# EAGLE design siguelineas (EAGLE 7.2.0)
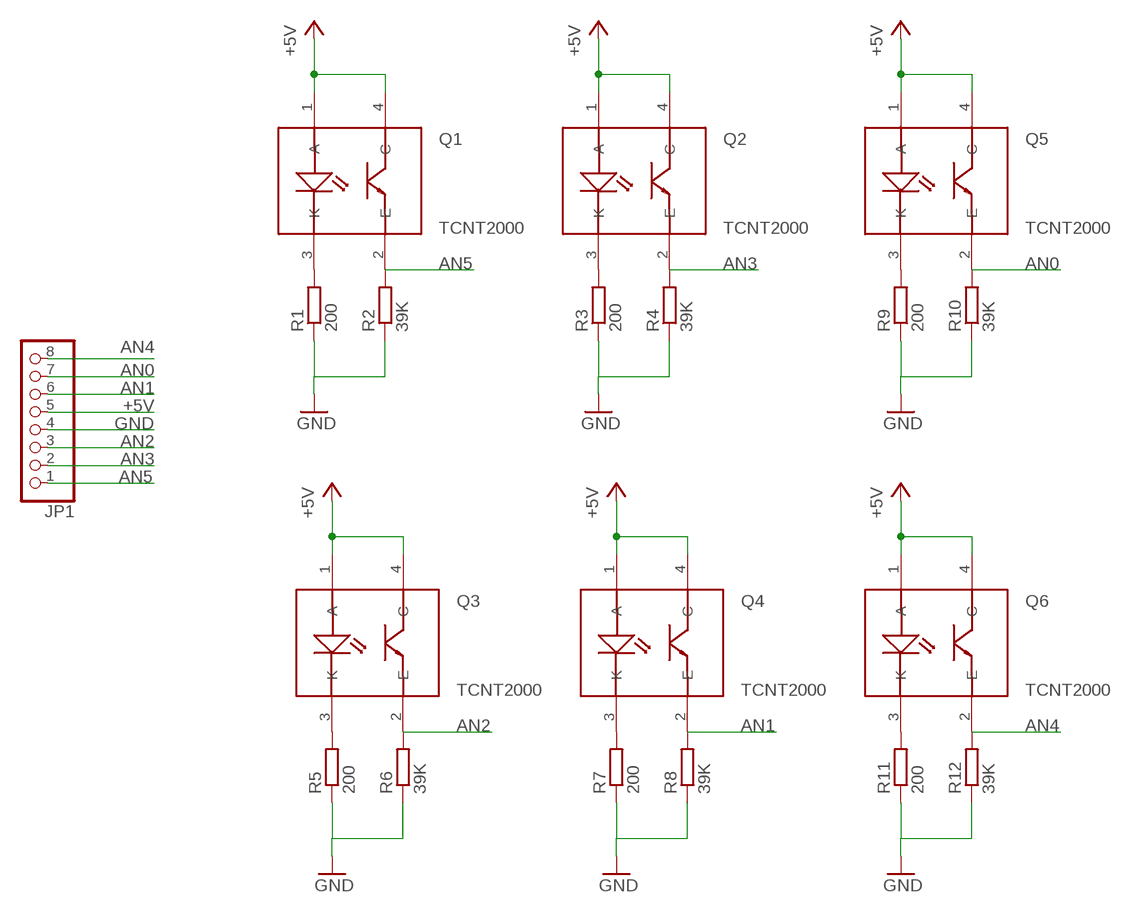
[diagram p0: schematic, sheet 1]

## Parts
JP1  PINHD-1X8  [1X08]
Q1  TCNT2000  [SMD]
Q2  TCNT2000  [SMD]
Q3  TCNT2000  [SMD]
Q4  TCNT2000  [SMD]
Q5  TCNT2000  [SMD]
Q6  TCNT2000  [SMD]
R1  200  R-EU_R0805  [R0805]
R2  39K  R-EU_R0805  [R0805]
R3  200  R-EU_R0805  [R0805]
R4  39K  R-EU_R0805  [R0805]
R5  200  R-EU_R0805  [R0805]
R6  39K  R-EU_R0805  [R0805]
R7  200  R-EU_R0805  [R0805]
R8  39K  R-EU_R0805  [R0805]
R9  200  R-EU_R0805  [R0805]
R10  39K  R-EU_R0805  [R0805]
R11  200  R-EU_R0805  [R0805]
R12  39K  R-EU_R0805  [R0805]

## Nets
+5V: JP1.5 Q1.1(A) Q1.4(C) Q2.1(A) Q2.4(C) Q3.1(A) Q3.4(C) Q4.1(A) Q4.4(C) Q5.1(A) Q5.4(C) Q6.1(A) Q6.4(C)
AN0: JP1.7 Q5.2(E) R10.2
AN1: JP1.6 Q4.2(E) R8.2
AN2: JP1.3 Q3.2(E) R6.2
AN3: JP1.2 Q2.2(E) R4.2
AN4: JP1.8 Q6.2(E) R12.2
AN5: JP1.1 Q1.2(E) R2.2
GND: JP1.4 R1.1 R2.1 R3.1 R4.1 R5.1 R6.1 R7.1 R8.1 R9.1 R10.1 R11.1 R12.1
N$1: Q1.3(K) R1.2
N$2: Q2.3(K) R3.2
N$3: Q3.3(K) R5.2
N$4: Q4.3(K) R7.2
N$5: Q5.3(K) R9.2
N$6: Q6.3(K) R11.2

## Library data of the parts
JP1 = pinhead:PINHD-1X8: PIN HEADER
Q1-Q6 = Siguelineas:TCNT2000
R1-R12 = rcl:R-EU_: RESISTOR, European symbol

## Board
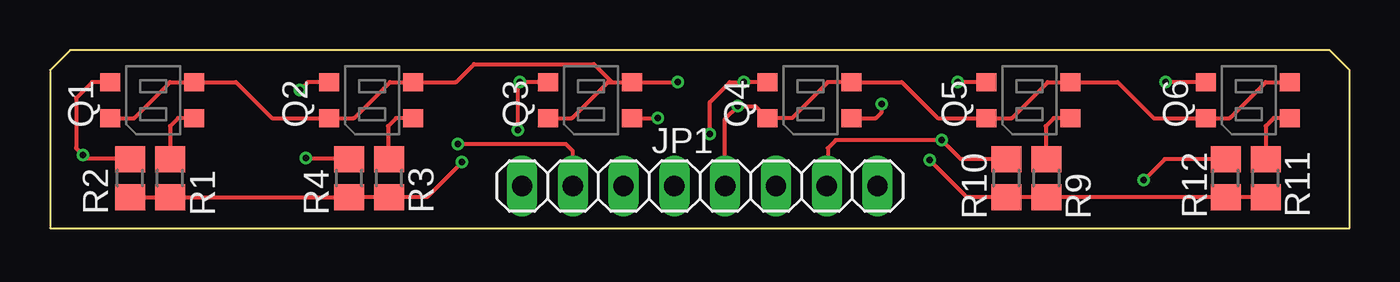
[diagram p1: board, top side]
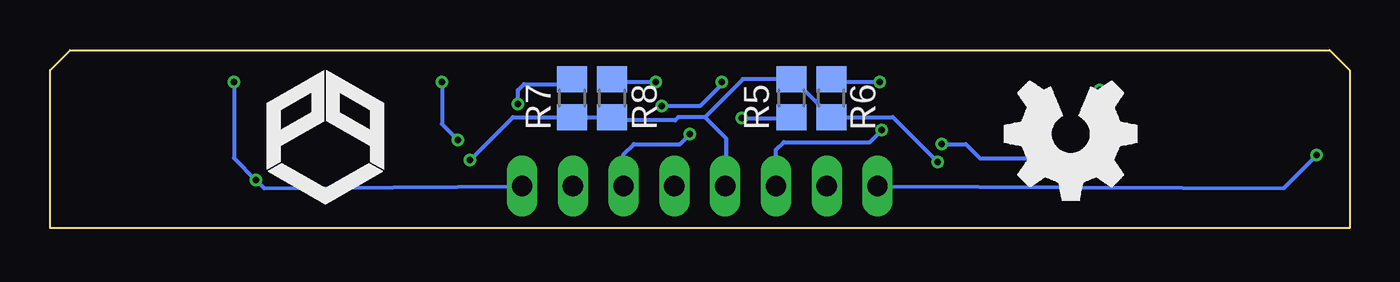
[diagram p2: board, bottom side, seen from below]

Size 65 x 8.9 mm. Coordinates in mm from the lower left corner, seen from the top.
Outline: 0,0 65,0 65,7.9 64,8.9 1,8.9 0,7.9 0,0
Copper layers (1*16): Top 0.035mm / dielectric 1.5mm / Bottom 0.035mm
Design rules "EagleRules": minimum track width 7mil, minimum drill 12mil, track to track 7mil, track to pad 7mil, pad to pad 7mil, via to via 7mil, smd to smd 0mil, copper to edge 20mil, drill to drill 10mil, minimum pad ring 10mil, minimum via ring 6mil, stop-mask expansion 2mil, vias tented up to drill 25mil, thermal gap 10mil

### Footprints (pad centres in the part's own frame; a part is rotated, then mirrored left to right if it is on the bottom)
1X08 = drill 1.016 long: 1 -8.89,0; 2 -6.35,0; 3 -3.81,0; 4 -1.27,0; 5 1.27,0; 6 3.81,0; 7 6.35,0; 8 8.89,0
SMD = smd 0.9 x 1: 1 0,0; 2 1.8,0; 3 0,-4.2; 4 1.8,-4.2
R0805 = smd 1.3 x 1.5: 1 -0.95,0; 2 0.95,0

### Placement (x,y rotation side)
JP1  32.5,2.1 0 top
Q1  3,5.5 90 top
Q2  13.96,5.5 90 top
Q3  24.92,5.5 90 top
Q4  35.88,5.5 90 top
Q5  46.84,5.5 90 top
Q6  57.8,5.5 90 top
R1  6,2.5 90 top
R2  4,2.5 90 top
R3  16.96,2.5 90 top
R4  14.96,2.5 90 top
R5  27.92,6.5 270 bottom
R6  25.92,6.5 90 bottom
R7  38.88,6.5 90 bottom
R8  36.88,6.5 90 bottom
R9  49.84,2.5 90 top
R10  47.84,2.5 90 top
R11  60.8,2.5 90 top
R12  58.8,2.5 90 top

### Tracks (layer width: path | path; a pad name or v marks a point on that pad's centre or on a via)
+5V  (via drill 0.3 pad 0.61)
  Top 0.203: Q1.1 4.2,5.5 6,7.3 Q1.4 9.3,7.3 11.1,5.5 Q2.1 15.2,5.5 17,7.3 Q2.4 20.3,7.3 21.2,8.2 27.2,8.2 28.1,7.3 | Q3.1 26.1,5.5 27.9,7.3 28.1,7.3 | 28.1,7.3 Q3.4 v31.4,7.3 | Q6.4 60.8,7.3 59,5.5 Q6.1 55.2,5.5 53.4,7.3 Q5.4 49.9,7.3 48.1,5.5 Q5.1 44.4,5.5 42.6,7.3 Q4.4 38.9,7.3 37.1,5.5 Q4.1 35.28,6.1 v34.4,6.1 33.77,5.47 JP1.5
  Bottom 0.203: v31.4,7.3 31.4,7.2 32.5,6.1 v34.4,6.1
AN0  (via drill 0.3 pad 0.61)
  Top 0.203: R10.2 45.55,3.45 v44.6,4.4 39.3,4.4 38.9,4 38.9,2.05 JP1.7 | Q5.2 v45.4,7.3
  Bottom 0.203: v45.4,7.3 45.4,5.2 v44.6,4.4
AN1  (via drill 0.3 pad 0.61)
  Top 0.203: Q4.2 v34.7,7.3 34,7.3 33,6.3 v33,4.7
  Bottom 0.203: v34.7,7.3 36.73,7.3 R8.2 | JP1.6 36.31,3.69 35.8,4.2 33.5,4.2 v33,4.7
AN2  (via drill 0.3 pad 0.61)
  Top 0.203: Q3.2 v23.5,7.3 23.4,7.2 v23.4,4.9
  Bottom 0.203: v23.5,7.3 25.77,7.3 R6.2 | JP1.3 28.69,3.91 28.3,4.3 24,4.3 v23.4,4.9
AN3  (via drill 0.3 pad 0.61)
  Top 0.203: Q2.2 12.9,7.3 v12.5,6.9 | v12.8,3.5 14.91,3.5 R4.2 | JP1.2 26.15,3.85 25.8,4.2 v20.4,4.2
  Bottom 0.203: v12.5,6.9 12.5,3.8 v12.8,3.5 18.5,3.5 19.2,4.2 v20.4,4.2
AN4  (via drill 0.3 pad 0.61)
  Top 0.203: R12.2 55.75,3.45 v54.7,2.4 | Q6.2 v55.8,7.3
  Bottom 0.203: JP1.8 54.3,2 v54.7,2.4 55.8,3.5 v55.8,7.3
AN5  (via drill 0.3 pad 0.61)
  Top 0.203: Q1.2 2.1,7.3 1.3,6.5 1.3,4 v1.65,3.65 1.8,3.5 3.95,3.5 R2.2
  Bottom 0.203: JP1.1 3.3,2 v1.65,3.65
GND  (via drill 0.3 pad 0.61)
  Top 0.203: R1.1 R2.1 R4.1 R3.1 18.85,1.55 v20.6,3.3 | R11.1 R12.1 R9.1 R10.1 45.85,1.55 v44,3.4
  Bottom 0.203: v44,3.4 41.85,5.55 R7.1 R8.1 36.72,5.38 33.73,5.38 33.57,5.55 32.25,5.55 | v20.6,3.3 22.85,5.55 R6.1 27.82,7.45 R5.1 30.35,7.45 32.25,5.55 | 32.25,5.55 31.2,4.5 31.2,2.03 JP1.4
N$1
  Top 0.203: Q1.3 6.4,5.5 6,5.1 R1.2
N$2
  Top 0.203: Q2.3 17.3,5.5 16.9,5.1 16.9,3.51 R3.2
N$3  (via drill 0.3 pad 0.61)
  Top 0.203: Q3.3 v30.4,5.5
  Bottom 0.203: v30.4,5.5 27.97,5.5 R5.2
N$4  (via drill 0.3 pad 0.61)
  Top 0.203: Q4.3 41.3,5.5 41.6,5.8 v41.6,6.2
  Bottom 0.203: v41.6,6.2 41.6,6.9 41.3,7.2 39.13,7.2 R7.2
N$5
  Top 0.203: Q5.3 50.2,5.5 49.8,5.1 49.8,3.49 R9.2
N$6
  Top 0.203: Q6.3 61.2,5.5 60.8,5.1 R11.2

### Text on the board
tNames: Q1 | Q2 | Q3 | Q4 | Q5 | Q6